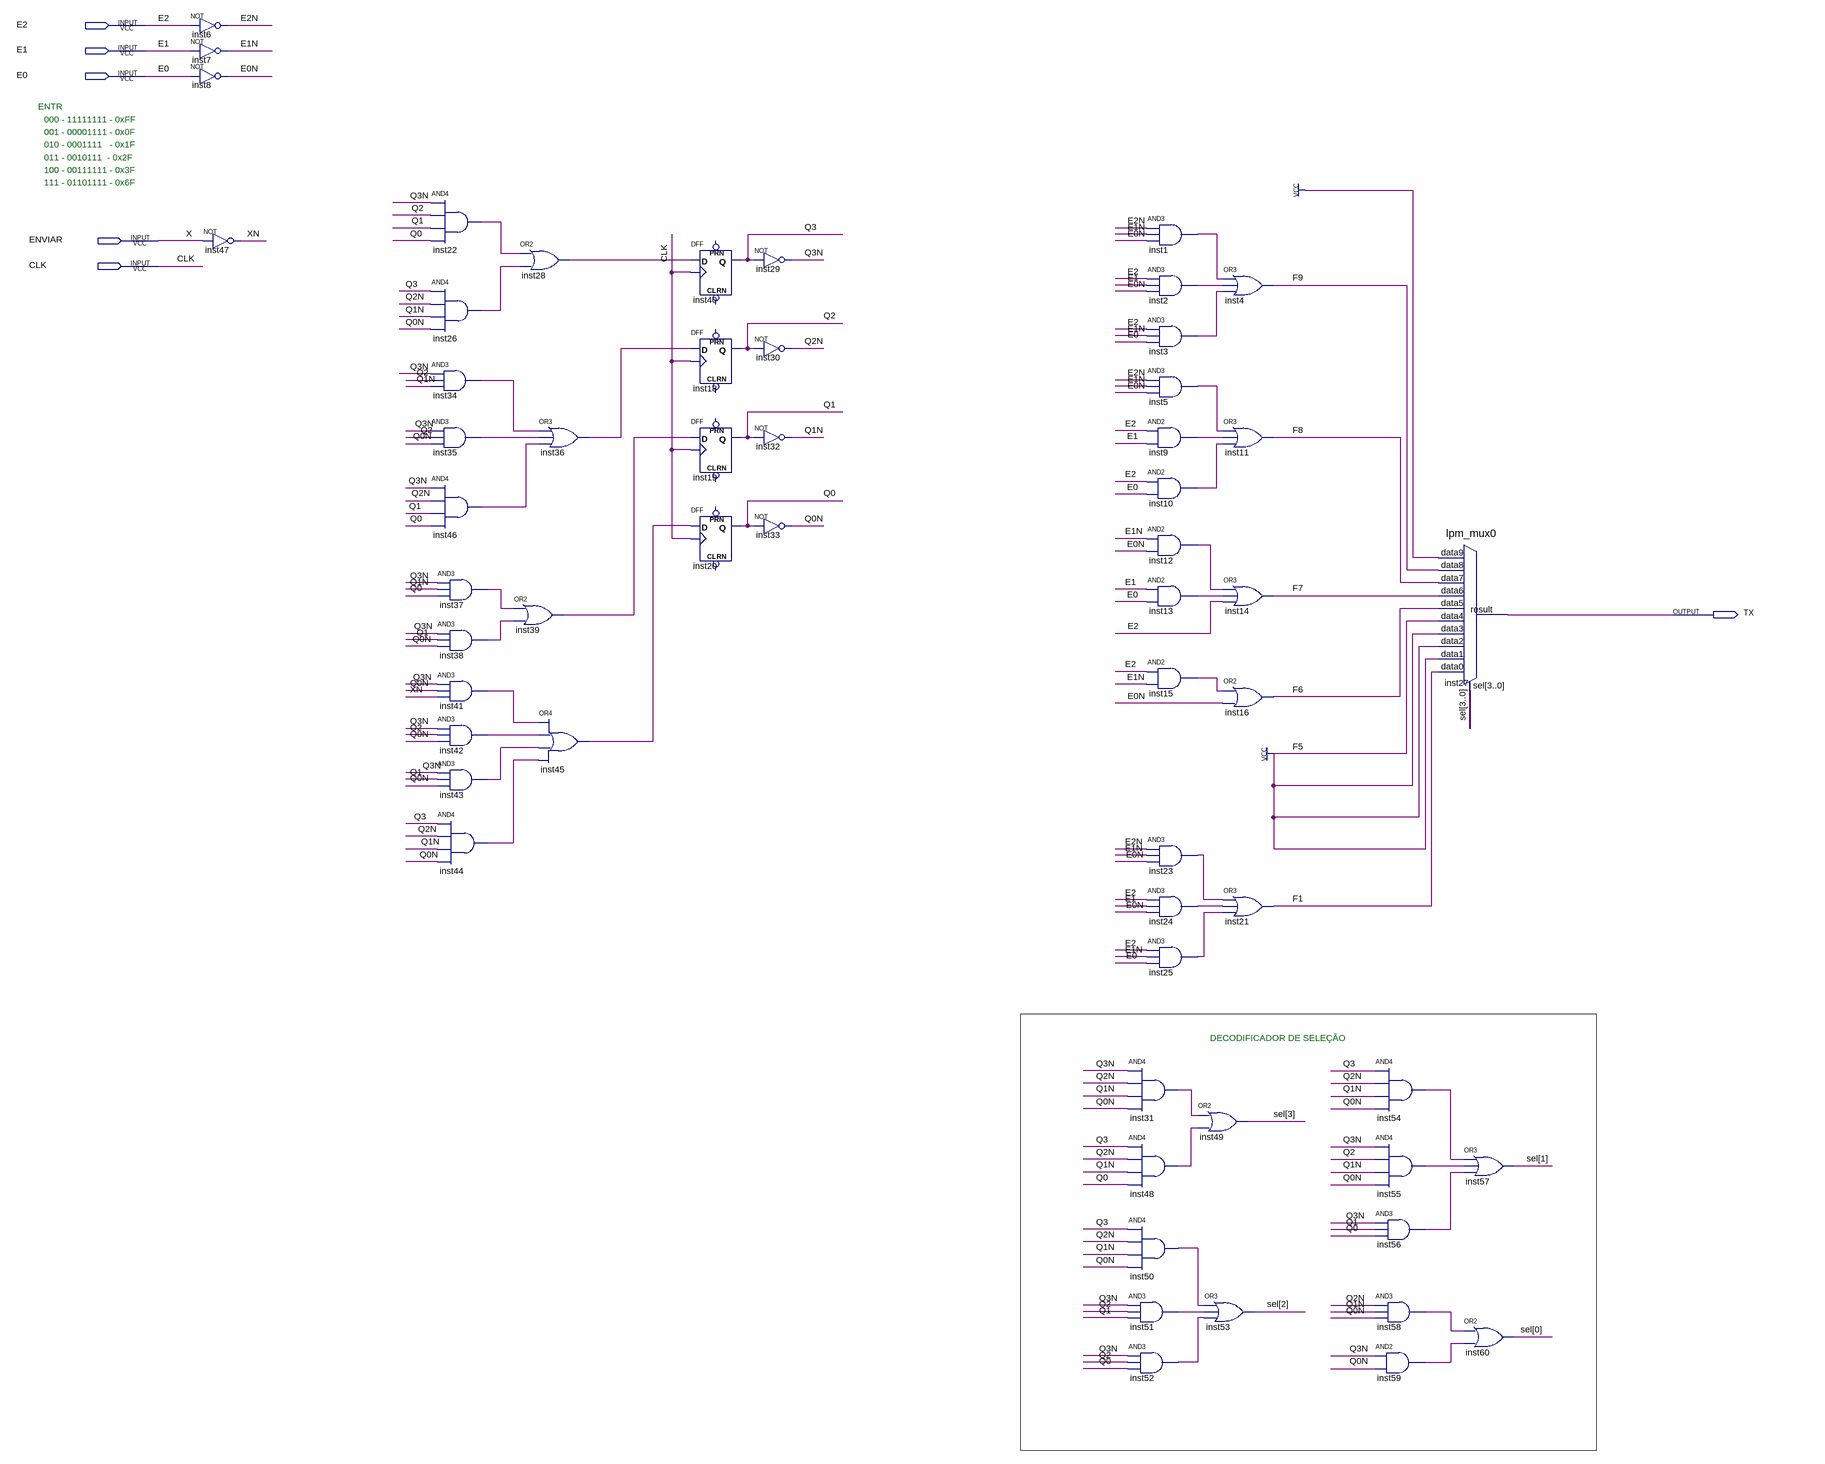
[diagram p0: schematic sheet]
// Quartus schematic envia_dados.bdf as structural Verilog: 59 symbols, 6 pins
module envia_dados (
  input  E2,
  input  E1,
  input  E0,
  input  ENVIAR,
  input  CLK,
  output TX
);

  wire E0N, E1N, E2N, F1, F6, F7, F8, F9, inst1_out, inst2_out, inst3_out, inst5_out, inst9_out, inst10_out,
       inst12_out, inst13_out, inst15_out, inst22_out, inst23_out, inst24_out, inst25_out, inst26_out,
       inst28_out, inst31_out, inst34_out, inst35_out, inst36_out, inst37_out, inst38_out, inst39_out,
       inst41_out, inst42_out, inst43_out, inst44_out, inst45_out, inst46_out, inst48_out, inst50_out,
       inst51_out, inst52_out, inst54_out, inst55_out, inst56_out, inst58_out, inst59_out, Q0, Q0N, Q1, Q1N,
       Q2, Q2N, Q3, Q3N, XN;
  wire [3:0] sel;

  not inst6 (E2N, E2);
  not inst7 (E1N, E1);
  not inst8 (E0N, E0);
  not inst47 (XN, ENVIAR);
  and inst22 (inst22_out, Q3N, Q2, Q1, Q0);
  and inst26 (inst26_out, Q3, Q2N, Q1N, Q0N);
  and inst34 (inst34_out, Q3N, Q2, Q1N);
  and inst35 (inst35_out, Q3N, Q2, Q0N);
  and inst46 (inst46_out, Q3N, Q2N, Q1, Q0);
  and inst37 (inst37_out, Q3N, Q1N, Q0);
  and inst38 (inst38_out, Q3N, Q1, Q0N);
  and inst41 (inst41_out, Q3N, Q0N, XN);
  and inst42 (inst42_out, Q3N, Q2, Q0N);
  and inst43 (inst43_out, Q3N, Q1, Q0N);
  and inst44 (inst44_out, Q3, Q2N, Q1N, Q0N);
  or inst28 (inst28_out, inst22_out, inst26_out);
  or inst36 (inst36_out, inst34_out, inst35_out, inst46_out);
  or inst39 (inst39_out, inst37_out, inst38_out);
  or inst45 (inst45_out, inst41_out, inst42_out, inst43_out, inst44_out);
  DFF inst40 (.CLK(CLK), .D(inst28_out), .Q(Q3));  // open: CLRN, PRN
  DFF inst18 (.CLK(CLK), .D(inst36_out), .Q(Q2));  // open: CLRN, PRN
  DFF inst19 (.CLK(CLK), .D(inst39_out), .Q(Q1));  // open: CLRN, PRN
  DFF inst20 (.CLK(CLK), .D(inst45_out), .Q(Q0));  // open: CLRN, PRN
  not inst29 (Q3N, Q3);
  not inst30 (Q2N, Q2);
  not inst32 (Q1N, Q1);
  not inst33 (Q0N, Q0);
  and inst1 (inst1_out, E2N, E1N, E0N);
  and inst2 (inst2_out, E2, E1, E0N);
  and inst3 (inst3_out, E2, E1N, E0);
  and inst5 (inst5_out, E2N, E1N, E0N);
  and inst9 (inst9_out, E2, E1);
  and inst10 (inst10_out, E2, E0);
  and inst12 (inst12_out, E1N, E0N);
  and inst13 (inst13_out, E1, E0);
  and inst15 (inst15_out, E2, E1N);
  and inst23 (inst23_out, E2N, E1N, E0N);
  and inst24 (inst24_out, E2, E1, E0N);
  and inst25 (inst25_out, E2, E1N, E0);
  and inst31 (inst31_out, Q3N, Q2N, Q1N, Q0N);
  and inst48 (inst48_out, Q3, Q2N, Q1N, Q0);
  and inst50 (inst50_out, Q3, Q2N, Q1N, Q0N);
  and inst51 (inst51_out, Q3N, Q2, Q1);
  and inst52 (inst52_out, Q3N, Q2, Q0);
  or inst49 (sel[3], inst31_out, inst48_out);
  or inst53 (sel[2], inst50_out, inst51_out, inst52_out);
  or inst4 (F9, inst1_out, inst2_out, inst3_out);
  or inst11 (F8, inst5_out, inst9_out, inst10_out);
  or inst14 (F7, inst12_out, inst13_out, E2);
  or inst16 (F6, inst15_out, E0N);
  or inst21 (F1, inst23_out, inst24_out, inst25_out);
  and inst54 (inst54_out, Q3, Q2N, Q1N, Q0N);
  and inst55 (inst55_out, Q3N, Q2, Q1N, Q0N);
  and inst56 (inst56_out, Q3N, Q1, Q0);
  and inst58 (inst58_out, Q2N, Q1N, Q0N);
  and inst59 (inst59_out, Q3N, Q0N);
  lpm_mux0 inst27 (
    .data9(1'b1), .data8(F9), .data7(F8), .data6(F7), .data5(F6), .data4(1'b1), .data3(1'b1), .data2(1'b1),
    .data1(1'b1), .data0(F1), .sel(sel), .result(TX));
  or inst57 (sel[1], inst54_out, inst55_out, inst56_out);
  or inst60 (sel[0], inst58_out, inst59_out);

  // Other names for the same wires on the sheet: X = ENVIAR

  // Notes on the sheet:
  //   ENTR
  //   000 - 11111111 - 0xFF
  //   001 - 00001111 - 0x0F
  //   010 - 0001111   - 0x1F
  //   011 - 0010111  - 0x2F
  //   100 - 00111111 - 0x3F
  //   111 - 01101111 - 0x6F
  //   DECODIFICADOR DE SELEÇÃO
endmodule
